# Altium project Flixel.PrjPcb
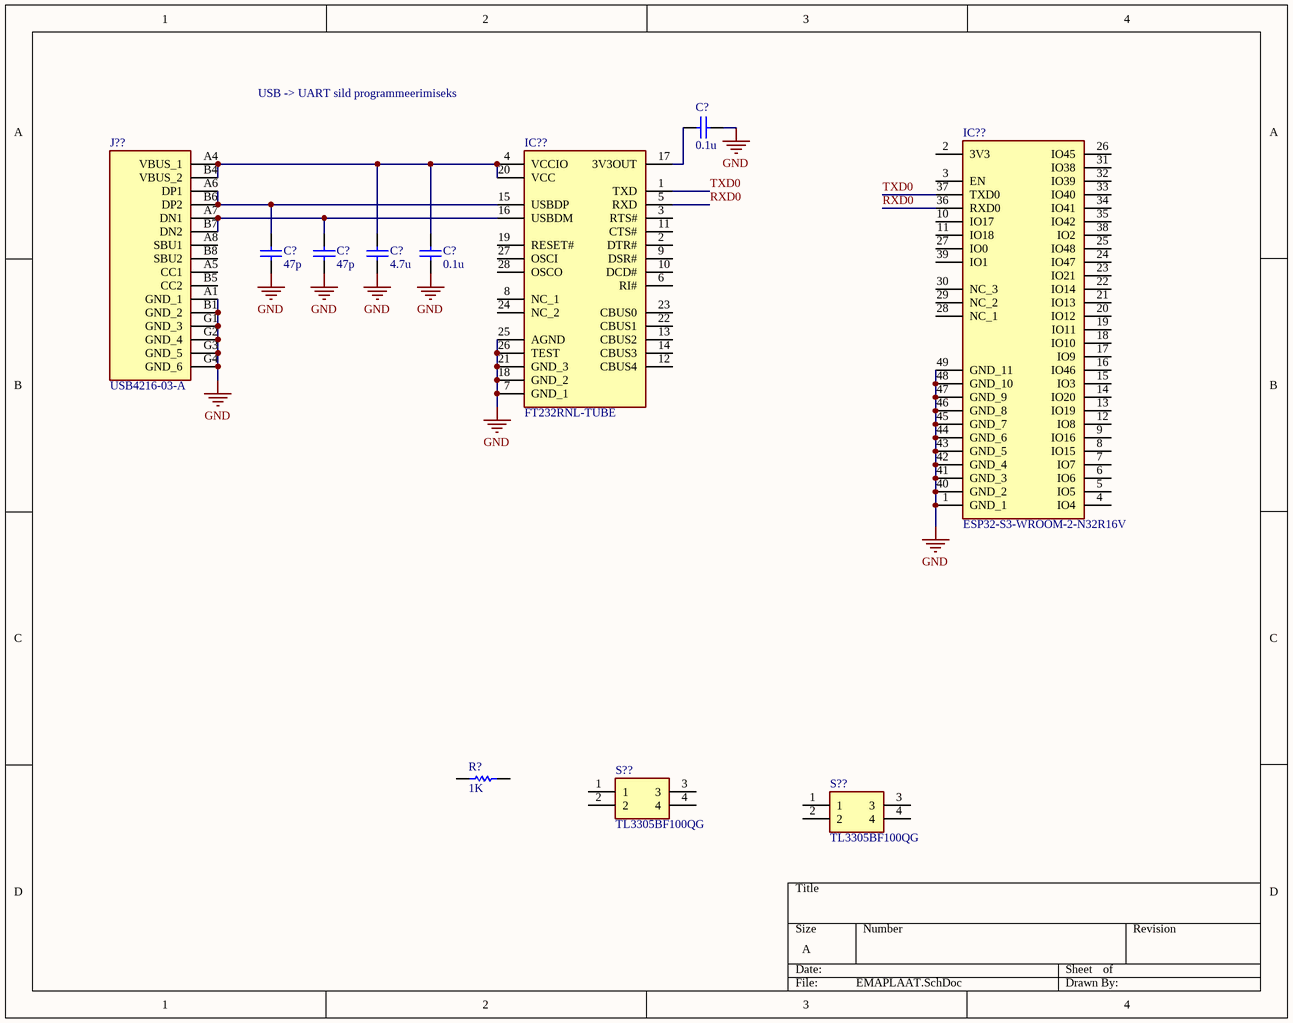
[diagram p0: EMAPLAAT.SchDoc]
1 sheet, 11 parts. Net scope: global (net labels, ports and power ports of the same name join across sheets).

## Sheet EMAPLAAT.SchDoc
size A; SheetNumber: 1; SheetTotal: 1

### Parts
(Parts that share a designator on the sheet are numbered #1, #2 ... from top to bottom, then left to right.)
C?#1  value 0.1u  (hidden comment: Capacitor)
C?#2  value 47p  (hidden comment: Capacitor)
C?#3  value 47p  (hidden comment: Capacitor)
C?#4  value 4.7u  (hidden comment: Capacitor)
C?#5  value 0.1u  (hidden comment: Capacitor)
IC??#1  ESP32-S3-WROOM-2-N32R16V  [ESP32S3WROOM2N32R16V]
IC??#2  FT232RNL-TUBE  [SOP65P780X200-28N]
J??  USB4216-03-A  [USB421603A]
R?  value 1K  (hidden comment: Resistor)
S??#1  TL3305BF100QG  [TL3305BF160QG]
S??#2  TL3305BF100QG  [TL3305BF160QG]

### Nets
GND: C?#1.2 C?#2.1 C?#3.1 C?#4.1 C?#5.1 IC??#1.1(GND_1) IC??#1.40(GND_2) IC??#1.41(GND_3) IC??#1.42(GND_4) IC??#1.43(GND_5) IC??#1.44(GND_6) IC??#1.45(GND_7) IC??#1.46(GND_8) IC??#1.47(GND_9) IC??#1.48(GND_10) IC??#1.49(GND_11) IC??#2.7(GND_1) IC??#2.18(GND_2) IC??#2.21(GND_3) IC??#2.25(AGND) IC??#2.26(TEST) J??.A1(GND_1) J??.B1(GND_2) J??.G1(GND_3) J??.G2(GND_4) J??.G3(GND_5) J??.G4(GND_6)
RXD0: IC??#1.36(RXD0) IC??#2.5(RXD)
TXD0: IC??#1.37(TXD0) IC??#2.1(TXD)
NetC?#1_1: C?#1.1 IC??#2.17(3V3OUT)
NetC?#2_2: C?#2.2 IC??#2.15(USBDP) J??.A6(DP1) J??.B6(DP2)
NetC?#3_2: C?#3.2 IC??#2.16(USBDM) J??.A7(DN1) J??.B7(DN2)
NetC?#4_2: C?#4.2 C?#5.2 IC??#2.4(VCCIO) IC??#2.20(VCC) J??.A4(VBUS_1) J??.B4(VBUS_2)

Not connected (* = marked no-connect by the designer): IC??#1 2(3V3) 3(EN) 4(IO4) 5(IO5) 6(IO6) 7(IO7) 8(IO15) 9(IO16) 10(IO17) 11(IO18) 12(IO8) 13(IO19) 14(IO20) 15(IO3) 16(IO46) 17(IO9) 18(IO10) 19(IO11) 20(IO12) 21(IO13) 22(IO14) 23(IO21) 24(IO47) 25(IO48) 26(IO45) 27(IO0) 28(NC_1) 29(NC_2) 30(NC_3) 31(IO38) 32(IO39) 33(IO40) 34(IO41) 35(IO42) 38(IO2) 39(IO1); IC??#2 2(DTR#) 3(RTS#) 6(RI#) 8(NC_1) 9(DSR#) 10(DCD#) 11(CTS#) 12(CBUS4) 13(CBUS2) 14(CBUS3) 19(RESET#) 22(CBUS1) 23(CBUS0) 24(NC_2) 27(OSCI) 28(OSCO); J?? A5(CC1) A8(SBU1) B5(CC2) B8(SBU2); R? 1 2; S??#1 1 2 3 4; S??#2 1 2 3 4

### Notes on the sheet
- USB -> UART sild programmeerimiseks

### Library data of the parts
C?#1-C?#5 = Capacitor: SimulationGenericComponent: True
IC??#1 = ESP32-S3-WROOM-2-N32R16V: Integrated Circuit; Manufacturer_Name: Espressif Systems; Datasheet Link: https://www.digikey.in/en/products/detail/espressif-systems/ESP32-S3-WROOM-2-N32R16V/25811280; Height: 3.25mm; Manufacturer_Part_Number: ESP32-S3-WROOM-2-N32R16V; Mouser Part Number: 356-SP32S3WM2N32R16V; Mouser Price/Stock: https://www.mouser.co.uk/ProductDetail/Espressif-Systems/ESP32-S3-WROOM-2-N32R16V?qs=%252BHhoWzUJg4Kf%2FwmS40wg%252BQ%3D%3D
IC??#2 = FT232RNL-TUBE: Integrated Circuit; Manufacturer_Name: FTDI Chip; Datasheet Link: https://ftdichip.com/wp-content/uploads/2023/03/DS_FT232RN.pdf; Height: 2mm; Manufacturer_Part_Number: FT232RNL-TUBE; Mouser Part Number: 895-FT232RNL-TUBE; Mouser Price/Stock: https://www.mouser.co.uk/ProductDetail/FTDI/FT232RNL-TUBE?qs=By6Nw2ByBD3n6DWgWW3egA%3D%3D; Arrow Part Number: FT232RNL-TUBE; Arrow Price/Stock: https://www.arrow.com/en/products/ft232rnl-tube/ftdi-chip?utm_currency=USD&region=europe
J?? = USB4216-03-A: Connector; Manufacturer_Name: GCT (GLOBAL CONNECTOR TECHNOLOGY); Datasheet Link: https://eu.mouser.com/datasheet/2/837/usb4216-3577180.pdf; Manufacturer_Part_Number: USB4216-03-A; Mouser Part Number: 640-USB4216-03-A; Mouser Price/Stock: https://www.mouser.co.uk/ProductDetail/GCT/USB4216-03-A?qs=Tc%252BHE9vUsnv1G2UWLFIexA%3D%3D
R? = Resistor: TC1: 0; SimulationGenericComponent: True; TC2: 0
S??#1 S??#2 = TL3305BF100QG: Switch; Manufacturer_Name: E-Switch; Datasheet Link: https://configured-product-images.s3.amazonaws.com/2D/specs/TL3305BF100QG.pdf; Manufacturer_Part_Number: TL3305BF100QG; Mouser Part Number: 612-TL3305BF100QG; Mouser Price/Stock: https://www.mouser.co.uk/ProductDetail/E-Switch/TL3305BF100QG?qs=IKkN%2F947nfDIPwqPQja%252BvQ%3D%3D